# EAGLE design WS2812B) (EAGLE 7.3.0)
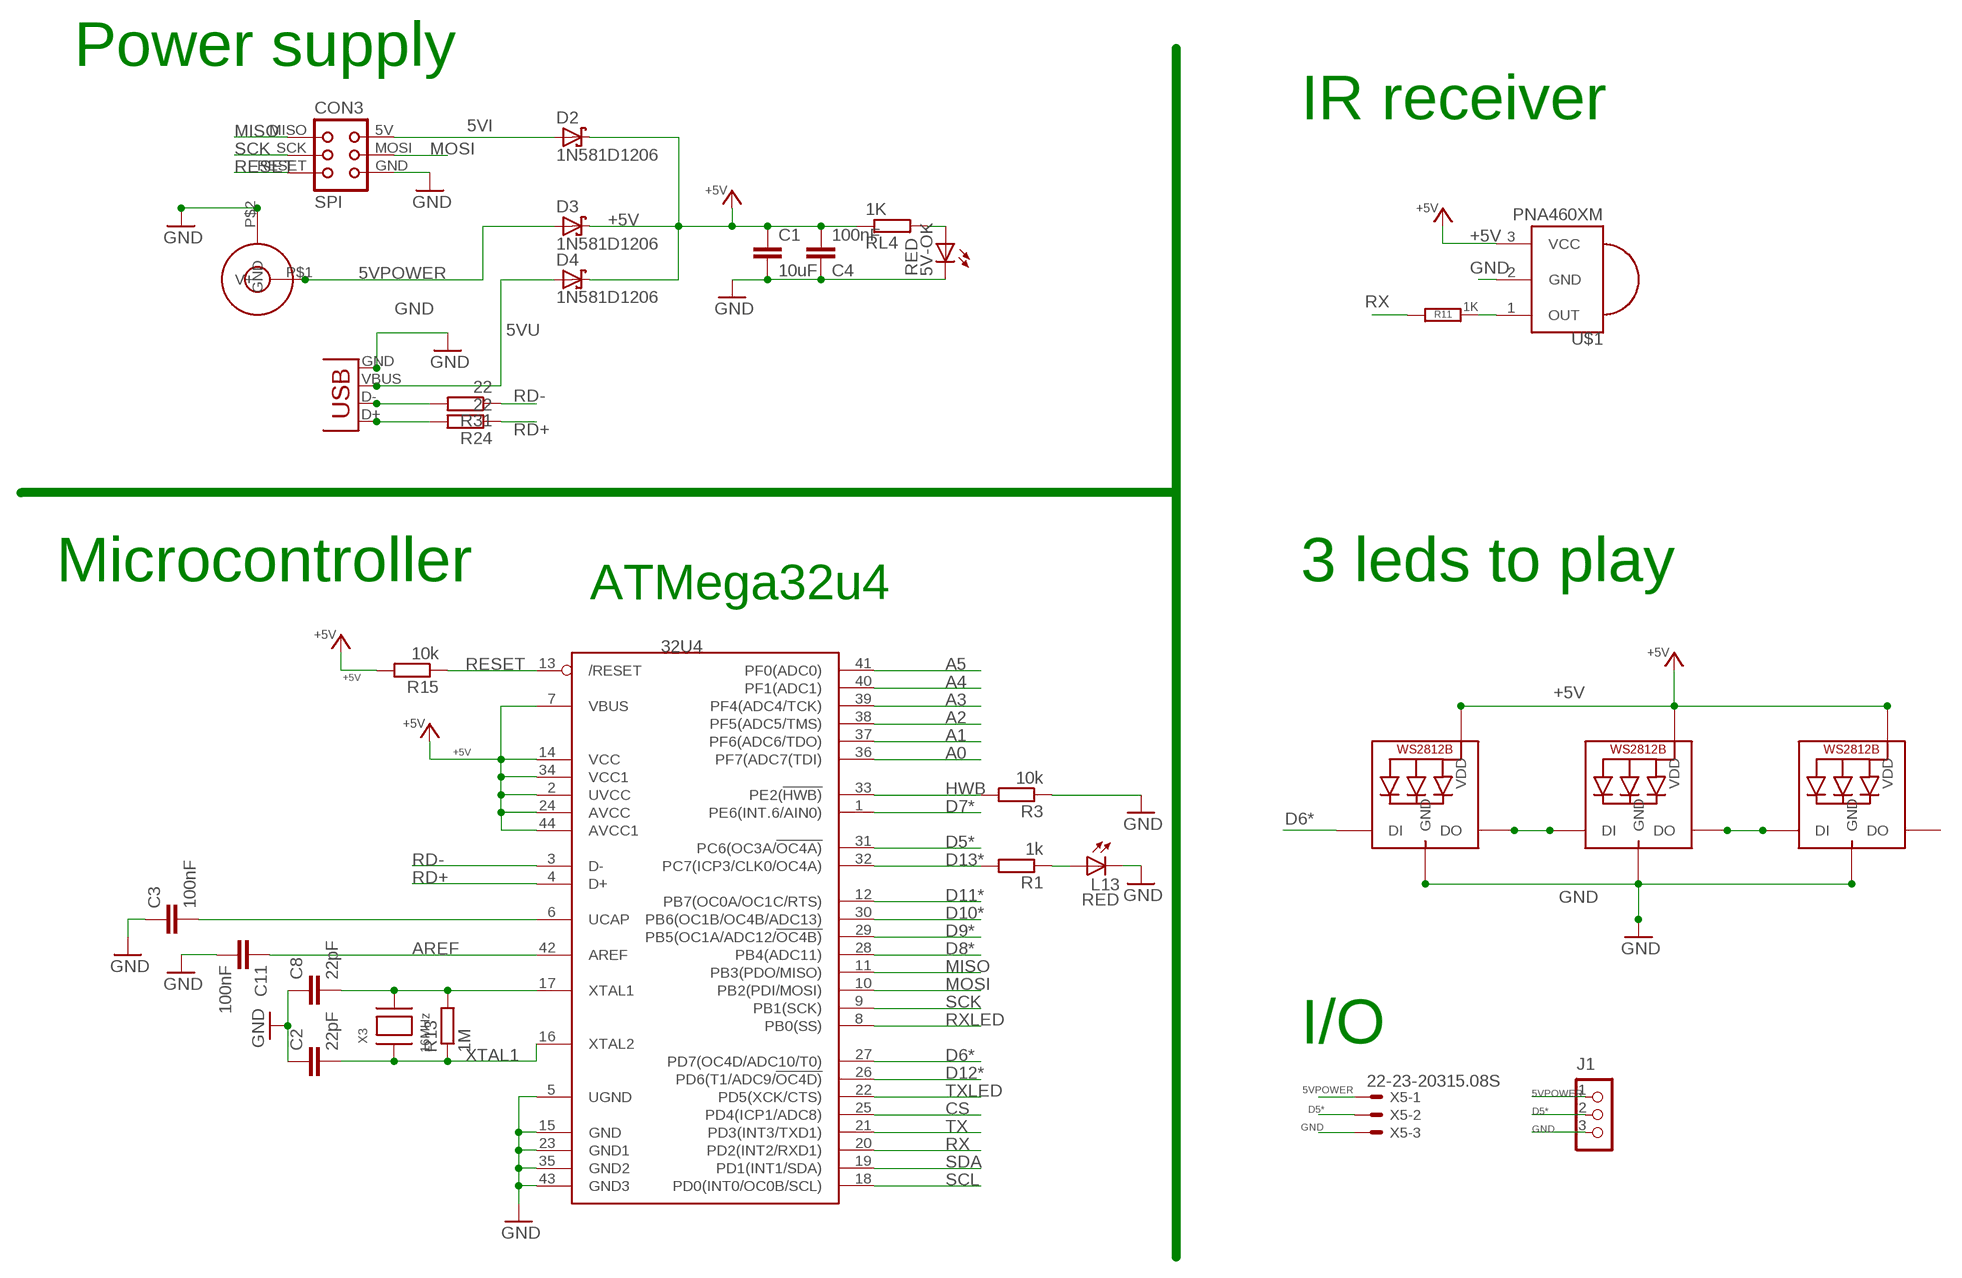
[diagram p0: schematic, sheet 1]

## Parts
5V-OK  RED  LEDCHIP-LED0805  [CHIP-LED0805]
C1  10uF  C-EUC1206  [C1206]
C2  22pF  C-EUC0805K  [C0805K]
C3  100nF  C-EUC0805K  [C0805K]
C4  100nF  C-EUC1206  [C1206]
C8  22pF  C-EUC0805K  [C0805K]
C11  100nF  C-EUC0805K  [C0805K]
CON2  JACK_DC_BARREL  [DC_BARREL]
CON3  SPI  TINYISPT  [TC2030-MCP-NL]
D2  1N581D1206  [LED-1206]
D3  1N581D1206  [LED-1206]
D4  1N581D1206  [LED-1206]
J1  CON_TERMINAL_BLOCK_03-5MM  [TERMINAL_BLOCK_3P_5]
L13  RED  LEDCHIP-LED0805  [CHIP-LED0805]
LED1  WS2812B_5050N  [WS2812B-NARROW]
LED2  WS2812B_5050N  [WS2812B-NARROW]
LED3  WS2812B_5050N  [WS2812B-NARROW]
R1  1k  R-EU_M0805  [M0805]
R3  10k  R-EU_M0805  [M0805]
R11  1K  R-EU_R0805  [R0805]
R13  1M  R-EU_M0805  [M0805]
R15  10k  R-EU_M0805  [M0805]
R24  22  R-EU_M0805  [M0805]
R31  22  R-EU_M0805  [M0805]
RL4  1K  R-EU_R0805  [R0805]
U$1  PNA460XM  [PNA460XM]
U$4  32U4  ATMEGA32U4-AU  [TQFP44]
X2  USB-MICROB  [USB-MICROB]
X3  16MHz  XTALNX6035  [NX6035]
X5  22-23-20315.08S  [3-PIN-5.08S]

## Nets
5VI: CON3.5V(VCC) D2.A
5VPOWER: CON2.P$1(V+) D3.A J1.1 X5.1
5VU: D4.A X2.VBUS
+5V [fine]: C1.1 C4.2 D2.C D3.C D4.C LED1.1-VDD(VDD) LED2.1-VDD(VDD) LED3.1-VDD(VDD) R15.2 RL4.1 U$1.3(VCC) U$4.2(UVCC) U$4.7(VBUS) U$4.14(VCC) U$4.24(AVCC) U$4.34(VCC1) U$4.44(AVCC1)
A0: U$4.36(PF7(ADC7(TDI))
A1: U$4.37(PF6(ADC6/TDO))
A2: U$4.38(PF5(ADC5/TMS))
A3: U$4.39(PF4(ADC4/TCK))
A4: U$4.40(PF1(ADC1))
A5: U$4.41(PF0(ADC0))
AREF: C11.1 U$4.42(AREF)
CS: U$4.25(PD4(ICP1/ADC8))
D5*: J1.2 U$4.31(PC6(OC3A/!OC4A)) X5.2
D6*: LED1.4-DIN(DI) U$4.27(PD7(OC4D/ADC10/T0))
D7*: U$4.1(PE6(INT.6/AIN0))
D8*: U$4.28(PB4(ADC11))
D9*: U$4.29(PB5(OC1A/ADC12/!OC4B))
D10*: U$4.30(PB6(OC1B/OC4B/ADC13))
D11*: U$4.12(PB7(OC0A/OC1C/RTS))
D12*: U$4.26(PD6(T1/ADC9/!OC4D))
D13*: R1.2 U$4.32(PC7(ICP3/CLK0/OC4A))
D_USB+ [USBA]: R24.2 X2.D+
D_USB- [USBA]: R31.2 X2.D-
GND [power]: 5V-OK.C C1.2 C2.1 C3.1 C4.1 C8.1 C11.2 CON2.P$2(GND) CON3.GND J1.3 L13.C LED1.3-GND(GND) LED2.3-GND(GND) LED3.3-GND(GND) R3.1 U$1.2(GND) U$4.5(UGND) U$4.15(GND) U$4.23(GND1) U$4.35(GND2) U$4.43(GND3) X2.GND X5.3
HWB: R3.2 U$4.33(PE2(!HWB))
MISO: CON3.MISO U$4.11(PB3(PDO/MISO))
MOSI: CON3.MOSI U$4.10(PB2(PDI/MOSI))
N$1: LED1.2-DOUT(DO) LED2.4-DIN(DI)
N$2: LED2.2-DOUT(DO) LED3.4-DIN(DI)
N$4: L13.A R1.1
N$9: R11.1 U$1.1(OUT)
N$12: 5V-OK.A RL4.2
N$16: C3.2 U$4.6(UCAP)
N$42: C8.2 R13.2 U$4.17(XTAL1) X3.P$2
RD+ [USBB]: R24.1 U$4.4(D+)
RD- [USBB]: R31.1 U$4.3(D-)
RESET: CON3.RESET R15.1 U$4.13(/RESET)
RX: R11.2 U$4.20(PD2(INT2/RXD1))
RXLED: U$4.8(PB0(SS))
SCK: CON3.SCK U$4.9(PB1(SCK))
SCL: U$4.18(PD0(INT0/OC0B/SCL))
SDA: U$4.19(PD1(INT1/SDA))
TX: U$4.21(PD3(INT3/TXD1))
TXLED: U$4.22(PD5(XCK/CTS))
XTAL1: C2.2 R13.1 U$4.16(XTAL2) X3.P$1
Unconnected: LED3.2-DOUT(DO)

## Notes on the sheet
- Power supply
- IR receiver
- Microcontroller | 3 leds to play
- ATMega32u4
- I/O

## Library data of the parts
5V-OK L13 = adafruit:LED: LED OSRAM: - CHIPLED LG R971, LG N971, LY N971, LG Q971, LY Q971, LO R971, LY R971 LH N974, LH R974 LS Q976, LO Q976, LY Q976 LO Q996 - Hyper CHIPLED LW Q18S LB Q993, LB Q99A, LB R99A - SideLED LS A670, LO A670, LY A670, LG A670, LP A670 LB A673, LV A673, LT A673, LW A673 LH A674 LY A675 LS A676, LA A676, LO A676, LY A676, LW A676 LS A679, LY A679, LG A679 - Hyper Micro SIDELED® LS Y876, LA Y876, LO Y876, LY Y876 LT Y87S - SmartLED LW L88C, LW L88S LB L89C, LB L89S, LG L890 LS L89K, LO L89K, LY L89K LS L896, LA L896, LO L896, LY L896 - TOPLED LS T670, LO T670, LY T670, LG T670, LP T670 LSG T670, LSP T670, LSY T670, LOP T670, LYG T670 LG T671, LOG T671, LSG T671 LB T673, LV T673, LT T673, LW T673 LH T674 LS T676, LA T676, LO T676, LY T676, LB T676, LH T676, LSB T676, LW T676 LB T67C, LV T67C, LT T67C, LS T67K, LO T67K, LY T67K, LW E67C LS E67B, LA E67B, LO E67B, LY E67B, LB E67C, LV E67C, LT E67C LW T67C LS T679, LY T679, LG T679 LS T770, LO T770, LY T770, LG T770, LP T770 LB T773, LV T773, LT T773, LW T773 LH T774 LS E675, LA E675, LY E675, LS T675 LS T776, LA T776, LO T776, LY T776, LB T776 LHGB T686 LT T68C, LB T68C - Hyper Mini TOPLED® LB M676 - Mini TOPLED Santana® LG M470 LS M47K, LO M47K, LY M47K Source: http://www.osram.convergy.de/
C1-C4 C8 C11 = rcl:C-EU: CAPACITOR, European symbol
CON2 = lpatiny:JACK_DC_BARREL
CON3 = lpatiny:TINYISP: CONNECTOR
D2-D4 = lpatiny:1N581*: 1.0A SCHOTTKY BARRIER RECTIFIER Source: http://www.diodes.com/datasheets/ds23001.pdf
J1 = dp_devices:CON_TERMINAL_BLOCK_03: 3 poles, wire to board connector
LED1-LED3 = adafruit:WS2812B
R1 R3 R11 R15 RL4 = resistor:R-EU_: RESISTOR, European symbol
R13 R24 R31 = rcl:R-EU_: RESISTOR, European symbol
U$1 = adafruit:PNA460XM: IR 38KHz receiver PNA4602 and related receivers http://www.ladyada.net/library/pcb/eaglelibrary.html
U$4 = adafruit:ATMEGA32U4: http://www.ladyada.net/library/eagle
X2 = SparkFun:USB: USB Connectors USB-B-PTH is fully proven SKU : PRT-00139 USB-miniB is fully proven SKU : PRT-00587 USB-A-PCB is untested. USB-A-H is throughly reviewed, but untested. Spark Fun Electronics SKU : PRT-00437 USB-B-SMT is throughly reviewed, but untested. Needs silkscreen touching up. USB-A-S has not been used/tested USB-MB-H has not been used/tested
X3 = lpatiny:XTAL: Low cost SMT crystals, no capacitors included http://www.ladyada.net/library/eagle
X5 = lpatiny:22-23-2031: .100" (2.54mm) Center Header - 3 Pin

## Net classes
0 default: width 0.254 mm
1 power: width 0.254 mm
2 VIN: width 0.254 mm
3 fine: width 0.254 mm
4 aref: width 0.254 mm
5 USBA: width 0.254 mm, clearance 0.254 mm
6 USBB: width 0.254 mm, clearance 0.254 mm

## Board
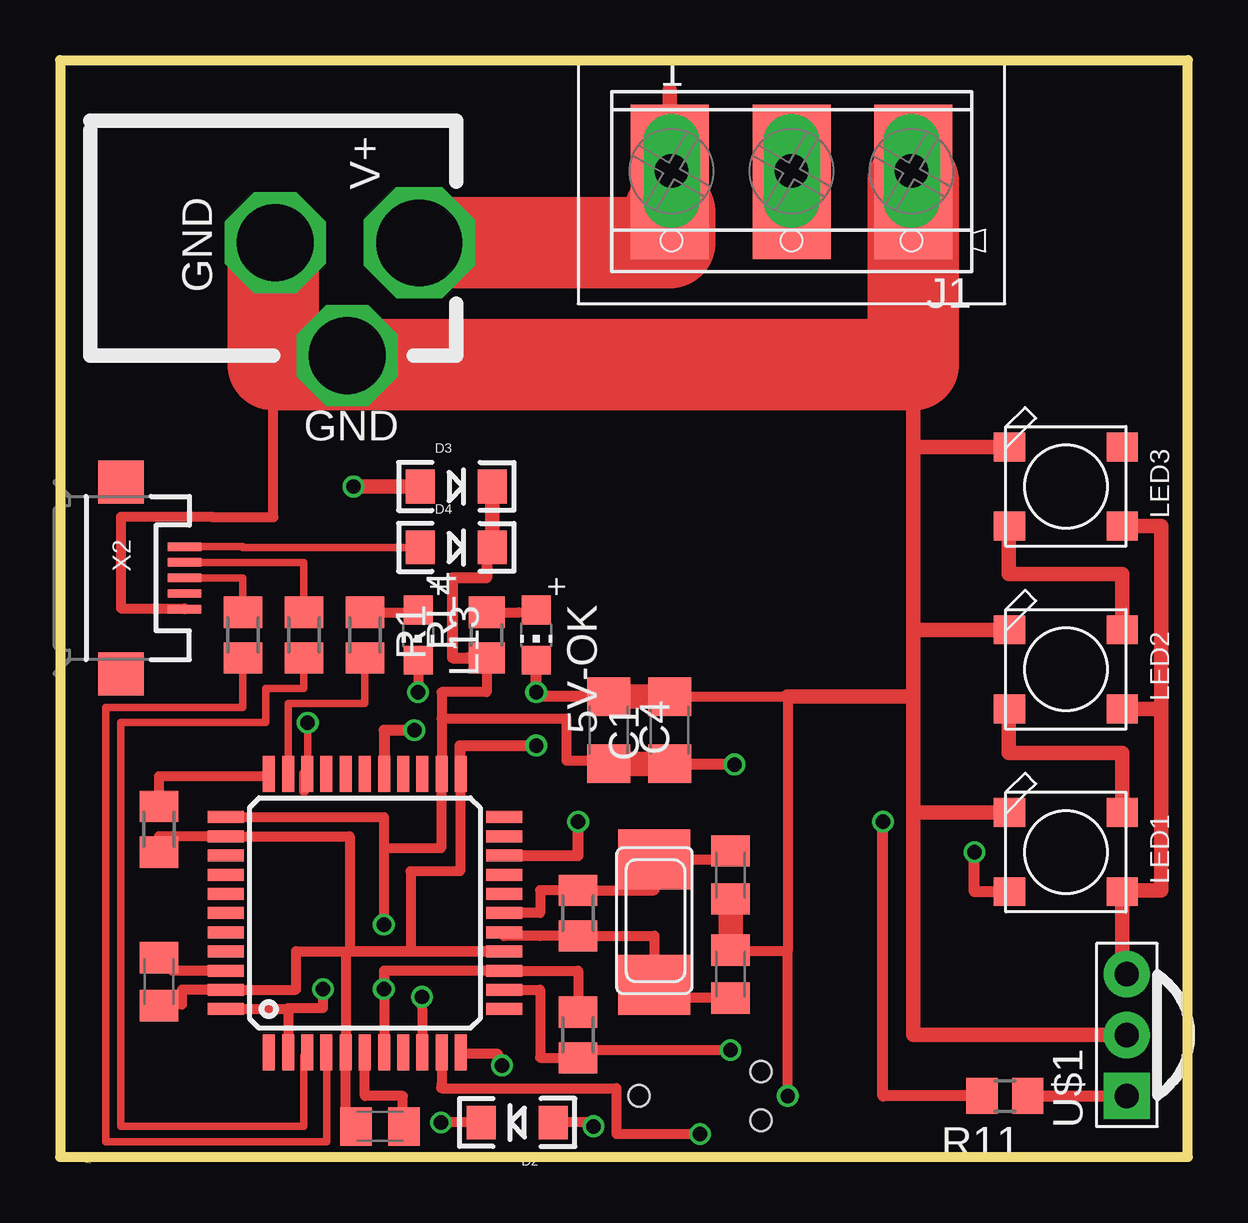
[diagram p1: board, top side]
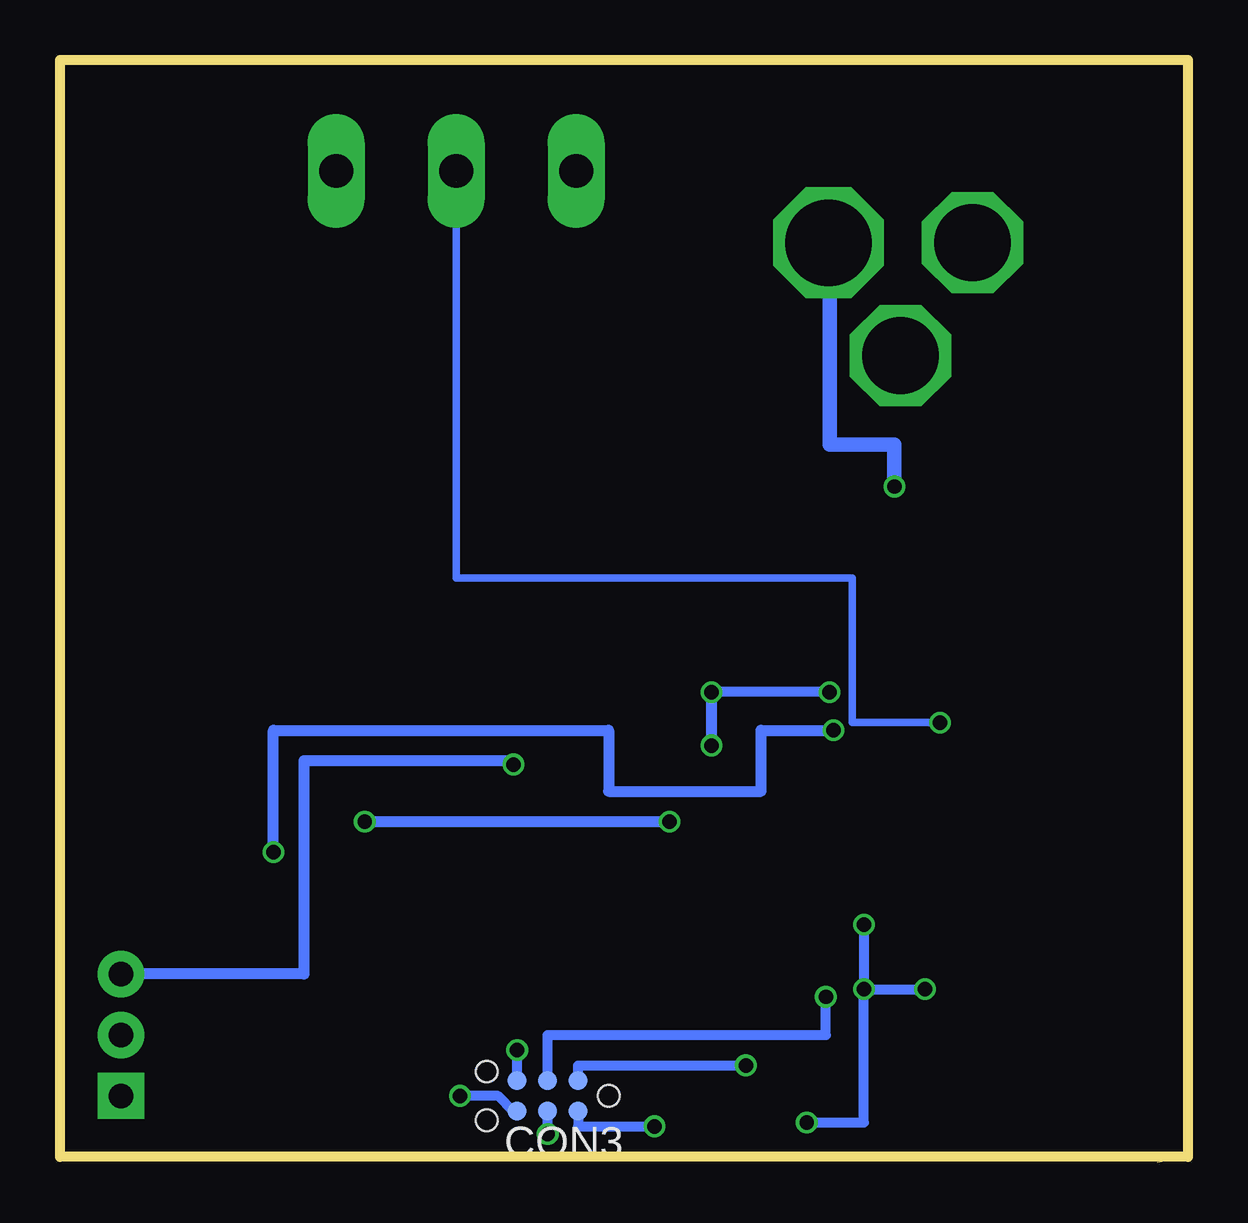
[diagram p2: board, bottom side, seen from below]

Size 46.99 x 45.97 mm. Coordinates in mm from the lower left corner, seen from the top.
Outline: 0,0.25 1.27,0
Outline: 0,0.25 46.99,0.25 46.99,45.97 0,45.97 0,0.25
Copper layers (1*16): Top 0.035mm / dielectric 1.5mm / Bottom 0.035mm
Design rules "Fusion_eagle_rule_v1.1": minimum track width 6mil, minimum drill 12mil, track to track 6mil, track to pad 6mil, pad to pad 6mil, via to via 6mil, smd to smd 0mil, copper to edge 10mil, drill to drill 10mil, minimum pad ring 10mil, minimum via ring 6mil, stop-mask expansion 2mil, vias tented up to drill 100mil, thermal gap 10mil
vRestrict: area 5.1,2.8 to 20.3,6.6; area 5.1,2.8 to 8.9,16.8; area 16.5,5.3 to 20.3,18; area 5.1,14.2 to 20.3,18; area 22.9,0.9 to 30.5,4.7

### Footprints (pad centres in the part's own frame; a part is rotated, then mirrored left to right if it is on the bottom)
CHIP-LED0805 = smd 1.2 x 1.2: A 0,-1.05; C 0,1.05
C1206 = smd 1.6 x 1.8: 1 -1.4,0; 2 1.4,0
C0805K = smd 1.3 x 1.6: 1 -1,0; 2 1,0
DC_BARREL = drill 3.6 pad 4.5 octagon: P$1 0,13.7 | drill 3.2 pad 4.064 octagon: P$2 0,7.7; P$3 4.7,10.7
TC2030-MCP-NL = smd 0.787 x 0.787: 5V 1.27,0.635; GND 3.81,0.635; MISO 1.27,-0.635; MOSI 2.54,0.635; RESET 3.81,-0.635; SCK 2.54,-0.635 | hole 0.889: 0,0; 5.08,-1.016; 5.08,1.016
LED-1206 = smd 1.2 x 1.4: A -1.5,0; C 1.5,0
TERMINAL_BLOCK_3P_5 = drill 1.4 pad 2.38 long: 1 5,-0.45; 2 0,-0.45; 3 -5,-0.45
WS2812B-NARROW = smd 1.3 x 1.2: 1-VDD 2.35,-1.65; 2-DOUT 2.35,1.65; 3-GND -2.35,1.65; 4-DIN -2.35,-1.65
M0805 = smd 1.3 x 1.6: 1 -0.95,0; 2 0.95,0
R0805 = smd 1.3 x 1.5: 1 -0.95,0; 2 0.95,0
PNA460XM = drill 1.016 pad 1.93 square: 1 -2.54,0 | drill 1.016 pad 1.93: 2 0,0; 3 2.54,0
TQFP44 = smd 1.5 x 0.5: 1 -5.8,4; 2 -5.8,3.2; 3 -5.8,2.4; 4 -5.8,1.6; 5 -5.8,0.8; 6 -5.8,0; 7 -5.8,-0.8; 8 -5.8,-1.6; 9 -5.8,-2.4; 10 -5.8,-3.2; 11 -5.8,-4; 23 5.8,-4; 24 5.8,-3.2; 25 5.8,-2.4; 26 5.8,-1.6; 27 5.8,-0.8; 28 5.8,0; 29 5.8,0.8; 30 5.8,1.6; 31 5.8,2.4; 32 5.8,3.2; 33 5.8,4 | smd 0.5 x 1.5: 12 -4,-5.8; 13 -3.2,-5.8; 14 -2.4,-5.8; 15 -1.6,-5.8; 16 -0.8,-5.8; 17 0,-5.8; 18 0.8,-5.8; 19 1.6,-5.8; 20 2.4,-5.8; 21 3.2,-5.8; 22 4,-5.8; 34 4,5.8; 35 3.2,5.8; 36 2.4,5.8; 37 1.6,5.8; 38 0.8,5.8; 39 0,5.8; 40 -0.8,5.8; 41 -1.6,5.8; 42 -2.4,5.8; 43 -3.2,5.8; 44 -4,5.8
USB-MICROB = smd 0.35 x 1.4: D+ 0,2.65; D- -0.65,2.65; GND 1.3,2.65; ID 0.65,2.65; VBUS -1.3,2.65 | smd 1.8 x 1.9: MT1 -4,0; MT2 4,0
NX6035 = smd 2.5 x 3: P$1 2.665,0; P$2 -2.565,0
3-PIN-5.08S = smd 3.251 x 6.452: 1 -5.08,0; 2 0,0; 3 5.08,0

### Placement (x,y rotation side)
5V-OK  19.84,22 180 top
C1  25.4,18.03 90 top
C2  27.94,7.87 270 top
C3  13.33,1.52 0 top
C4  22.86,18.03 270 top
C8  27.94,12 90 top
C11  4.13,7.56 270 top
CON2  1.27,38.35 270 top
CON3  24.13,2.79 180 bottom
D2  19.05,1.68 180 top
D3  16.51,28.19 0 top
D4  16.51,25.65 0 top
J1  30.48,40.89 180 top
L13  14.92,22 180 top
LED1  41.91,12.95 0 top
LED2  41.91,20.57 0 top
LED3  41.91,28.19 0 top
R1  12.7,22 270 top
R3  4.13,13.91 90 top
R11  39.37,2.79 180 top
R13  21.59,10.41 90 top
R15  21.59,5.33 90 top
R24  7.62,22 90 top
R31  10.16,22 90 top
RL4  17.78,22 90 top
U$1  44.45,5.33 90 top
U$4  12.7,10.41 90 top
X2  2.54,24.38 270 top
X3  24.77,10.1 270 top
X5  30.48,40.89 0 top

### Tracks (layer width: path | path; a pad name or v marks a point on that pad's centre or on a via)
5VI  (via drill 0.6)
  Top 0.406: v22.22,1.52 22.07,1.68 D2.A
  Bottom 0.406: CON3.5V 25.4,1.52 v22.22,1.52
5VPOWER  (via drill 0.6)
  Top 0.305: 25.4,41.34 X5.1
  Top 0.457: X5.1 25.4,38.35
  Top 0.61: J1.1 25.4,41.34 25.4,44.7 | v12.22,28.19 D3.A
  Top 3.81: CON2.P$1 25.4,38.35 25.4,39.62
  Bottom 0.61: CON2.P$1 14.92,38.35 14.92,29.94 12.22,29.94 v12.22,28.19
5VU
  Top 0.305: X2.VBUS 7.62,25.68 7.62,25.65 D4.A
+5V  (via drill 0.6)
  Top 0.406: U$4.44 9.5,6.41 | 9.5,6.41 U$4.2 | U$4.14 13.5,8.01 U$4.7 | U$4.14 13.49,8.01 v13.49,7.24 | v10.95,7.24 10.95,6.45 9.5,6.45 9.5,6.41 | 13.49,13.11 15.88,13.11 15.88,16.21 U$4.24 15.9,18.51 | 13.49,13.11 v13.49,9.94 | U$4.34 13.49,14.41 13.49,13.11 | U$4.14 21.59,8.01 R15.2 | D2.C v15.88,1.68 | RL4.1 17.78,19.62 15.9,19.62 15.9,18.51 | 22.86,16.76 21.11,16.76 21.11,18.51 15.9,18.51
  Top 0.457: D4.C 17.78,25.65 17.78,24.38 16.35,24.38 16.35,21.05 16.99,21.05 RL4.1 | C1.1 28.1,16.63 v28.1,16.61
  Top 0.61: D3.C D4.C | C4.2 22.86,16.76 | LED2.1-VDD 45.88,18.92 | 45.88,18.92 45.88,11.37 44.26,11.37 LED1.1-VDD 44.26,7.87 U$1.3 | LED3.1-VDD 45.88,26.54 45.88,18.92
  Top 1.016: C1.1 C4.2
  Bottom 0.406: v13.49,7.24 v10.95,7.24 | v13.49,9.94 v13.49,7.24 | v15.88,1.68 13.49,1.68 v13.49,7.24
  Bottom 0.457: v28.1,16.61 27.94,16.61 27.94,16.76 36.83,16.76 36.83,7.87 U$1.3
AREF
  Top 0.406: U$4.42 4.67,8.01 C11.1
D5*  (via drill 0.6)  (1 unrouted)
  Top 0.305: U$4.31 10.32,16.21 v10.32,18.35
  Top 0.406: U$4.31 10.16,16.21 10.16,15.49
  Top 0.457: J1.2 X5.2 30.48,38.35
  Bottom 0.305: v10.32,18.35 13.97,18.35 13.97,24.38 30.48,24.38 X5.2
D6*  (via drill 0.6)
  Top 0.457: LED1.4-DIN 38.1,11.3 v38.1,12.95 | v14.76,18.03 13.5,18.03 | 13.49,18.03 13.5,18.03 | 13.5,18.03 U$4.27
  Bottom 0.457: v38.1,12.95 38.1,18.03 24.13,18.03 24.13,15.49 17.78,15.49 17.78,18.03 v14.76,18.03
D13*
  Top 0.305: R1.2 12.7,19.14 9.5,19.14 U$4.32
D_USB+
  Top 0.305: R24.2 7.62,24.38 X2.D+
D_USB-
  Top 0.305: X2.D- 10.16,25.03 R31.2
GND  (via drill 0.6)
  Top 0.406: 27.94,9.14 C2.1 27.99,8.83 30.32,8.83 | X2.GND 5.19,23.11 2.54,23.11 2.54,26.92 6.35,26.92 8.89,26.92 8.89,34.54 | C3.1 11.9,1.52 U$4.5 11.9,8.81 U$4.15 18.5,8.83 14.61,8.83 | 12.06,8.83 9.84,8.83 9.84,7.21 U$4.43 5.08,7.21 5.08,6.6 4.13,6.6 C11.2 | 12.06,8.83 14.61,8.83 | 12.06,8.83 12.06,13.61 U$4.35 4.13,13.61 R3.1 | U$4.23 16.67,16.21 16.67,12.16 14.61,12.16 14.61,8.83 | v30.32,2.79 30.32,8.83 | L13.C v14.92,19.62 | v19.84,19.62 19.84,19.43 | C1.2 30.32,19.43 30.32,8.83
  Top 0.457: C4.1 19.84,19.43 5V-OK.C | J1.3 35.48,40.97 X5.3 35.56,29.46 | 16.67,16.21 16.67,17.4 v19.84,17.4
  Top 0.61: LED3.3-GND 35.56,29.84 | 35.56,29.84 35.56,33.27 | LED2.3-GND 35.56,22.22 | 35.56,22.22 35.56,29.46 35.56,29.84 | LED1.3-GND 35.56,14.6 | 35.56,14.6 35.56,19.43 | 35.56,19.43 35.56,22.22 | U$1.2 35.56,5.33 35.56,14.6 | 30.32,19.43 35.56,19.43
  Top 1.016: C1.2 C4.1 | C8.1 27.94,9.14
  Top 3.81: CON2.P$2 8.89,38.35 8.89,34.54 8.89,33.27 35.56,33.27 X5.3
  Bottom 0.406: CON3.GND 28.1,2.16 28.73,2.79 v30.32,2.79 | v14.92,19.62 v19.84,19.62
  Bottom 0.457: v19.84,17.4 v19.84,19.62
HWB
  Top 0.406: R3.2 4.13,16.13 8.7,16.13 U$4.33
MISO  (via drill 0.6)
  Top 0.406: v18.41,4.06 18.26,4.06 18.26,4.54 16.7,4.54 U$4.11
  Bottom 0.406: CON3.MISO 25.4,4.06 v18.41,4.06
MOSI  (via drill 0.6)
  Top 0.406: U$4.10 15.9,3.29 15.88,3.11 23.18,3.11 23.18,1.21 v26.67,1.21
  Bottom 0.406: v26.67,1.21 CON3.MOSI
N$1
  Top 0.61: LED2.4-DIN 39.53,18.92 39.53,17.08 44.26,17.08 LED1.2-DOUT
N$2
  Top 0.61: LED3.4-DIN 39.53,26.54 39.53,24.54 44.26,24.54 LED2.2-DOUT
N$4
  Top 0.406: R1.1 14.82,22.95 L13.A
N$9
  Top 0.457: R11.1 U$1.1
N$12
  Top 0.406: RL4.2 19.11,22.95 5V-OK.A
N$16
  Top 0.406: C3.2 14.29,1.52 14.29,2.79 12.7,2.79 U$4.6
N$42
  Top 0.406: U$4.17 20,10.41 20,11.36 R13.2 24.77,11.36 X3.P$2 27.94,12.66 C8.2
RD+
  Top 0.305: R24.1 7.62,18.99 1.91,18.99 1.91,0.89 11.11,0.89 11.11,4.6 U$4.4
RD-
  Top 0.305: U$4.3 10.16,4.47 10.16,1.52 2.54,1.52 2.54,18.35 8.57,18.35 8.57,19.78 10.16,19.78 R31.1
RESET  (via drill 0.6)
  Top 0.406: U$4.13 20,7.21 20,4.38 R15.1 21.59,4.7 v27.94,4.7
  Bottom 0.406: CON3.RESET v27.94,4.7
RX  (via drill 0.6)
  Top 0.457: R11.2 34.29,2.79 v34.29,14.22 | U$4.20 21.59,12.81 v21.59,14.22
  Bottom 0.457: v21.59,14.22 v34.29,14.22
SCK  (via drill 0.6)
  Top 0.406: v15.08,6.92 15.1,5.97 U$4.9
  Bottom 0.406: CON3.SCK 26.67,5.33 15.08,5.33 v15.08,6.92
XTAL1
  Top 0.406: U$4.16 18.5,9.46 20,9.46 R13.1 24.77,9.46 X3.P$1 24.77,6.87 C2.2

### Text on the board
tDocu: 5V | OUT | GND | Led control v1.0 | D6 | RX
203bmp: C:/Users/G/Pictures/logo_epfl.bmp